# Altium schematic sheet Gero_Board..SchDoc
size B; SheetNumber: 2; SheetTotal: 3
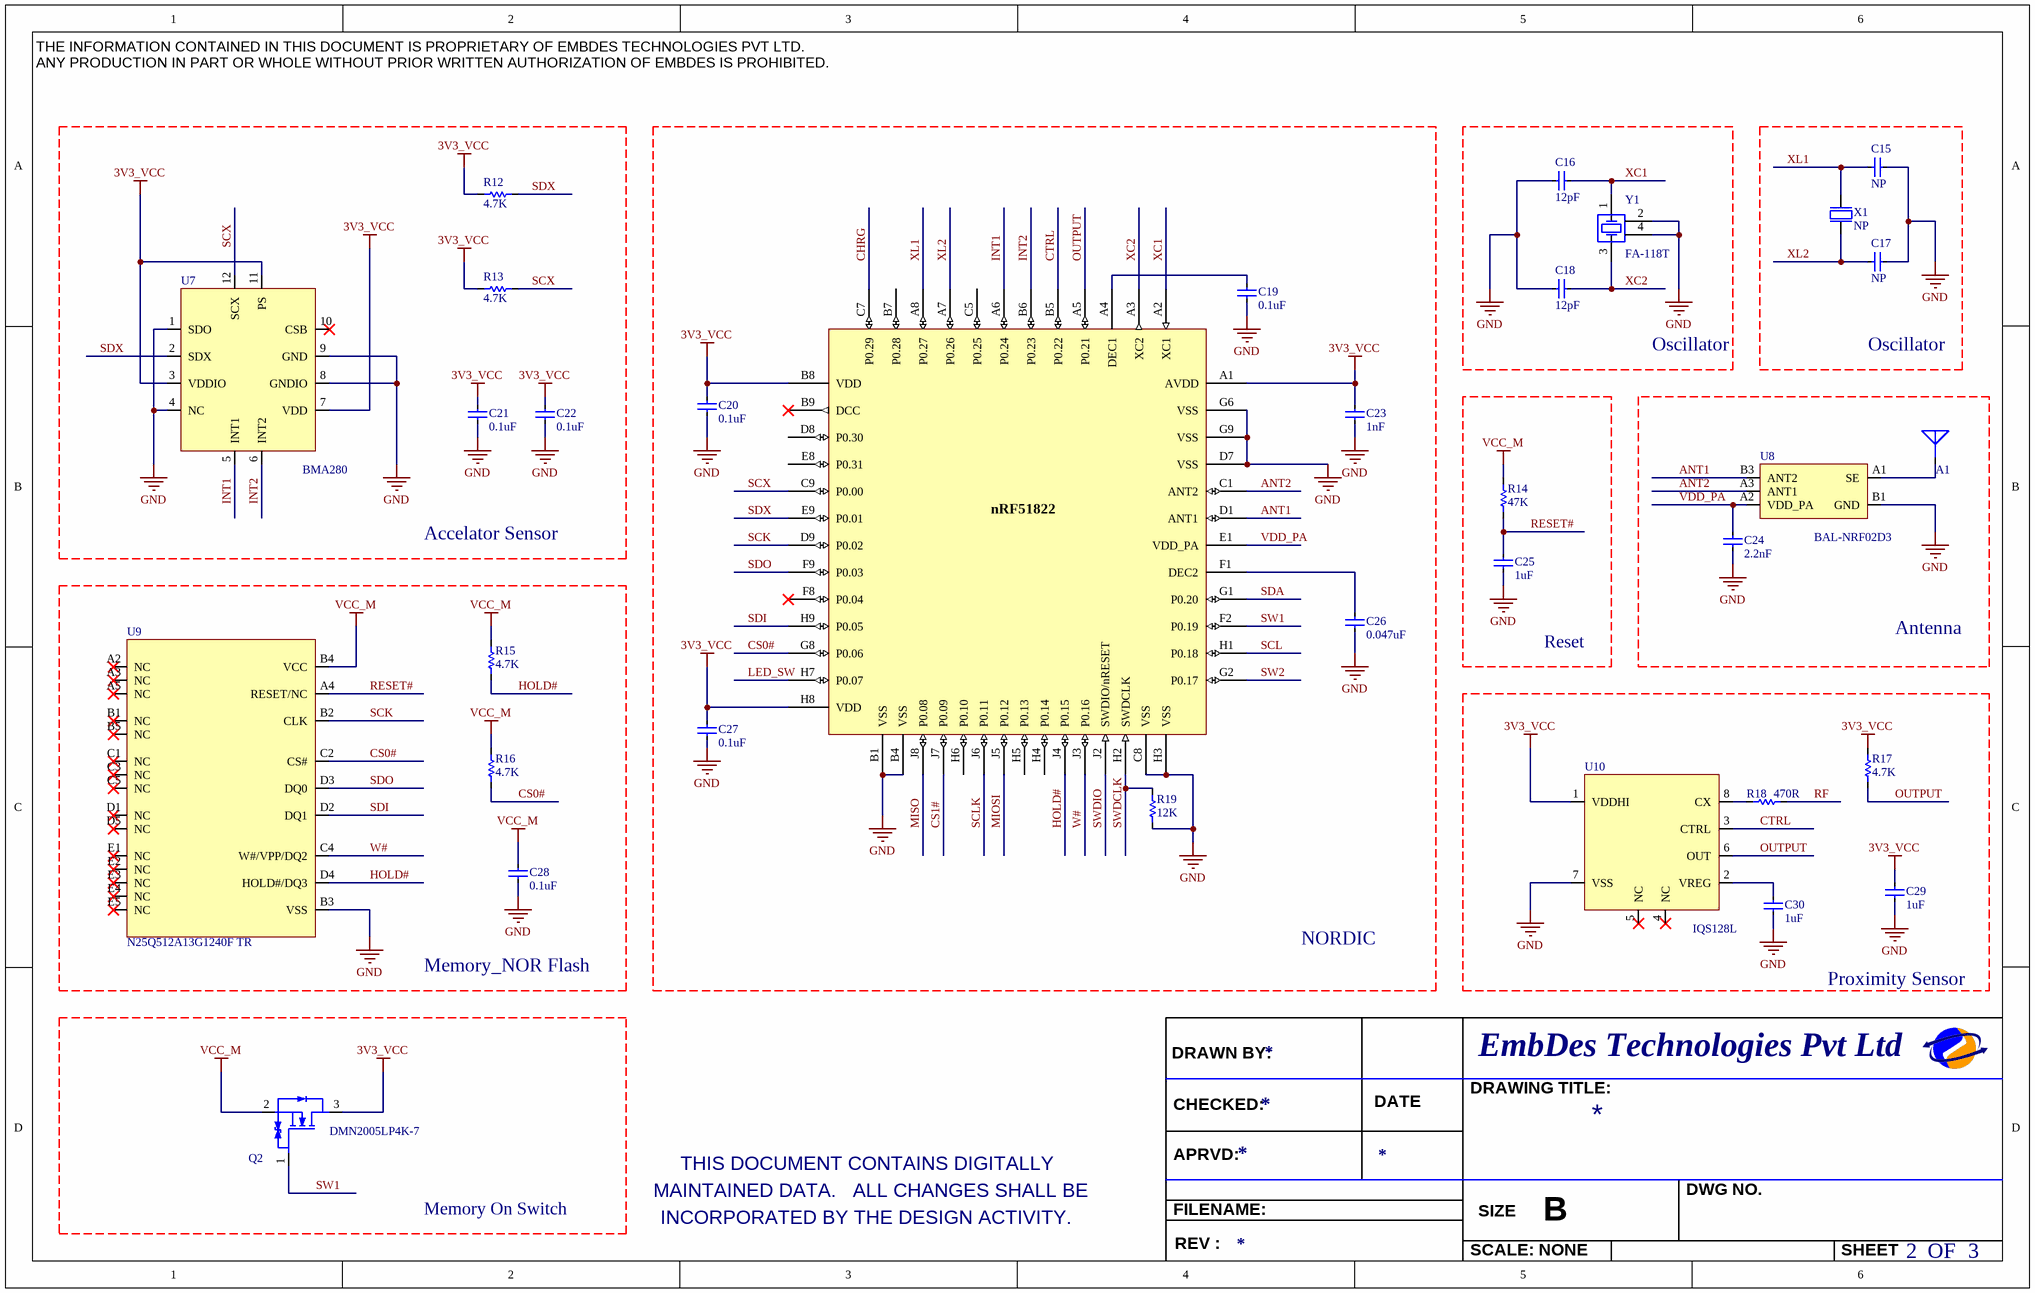
[diagram p0: Gero_Board..SchDoc]

## Parts
*1  ol Bluetooth Low Energy and 2.4GHz proprietary system-on-chip  (value not drawn)
A1  DCAK0008-Dielectric Chip Antenna  (value not drawn)
C15  value NP  [CAPC1005X04L]  (hidden comment: CAP CER 12PF 25V 5% NP0 0201)
C16  value 12pF  [CAPC1005X04L]  (hidden comment: CAP CER 12PF 25V 5% NP0 0201)
C17  value NP  [CAPC1005X04L]  (hidden comment: CAP CER 12PF 25V 5% NP0 0201)
C18  value 12pF  [CAPC1005X04L]  (hidden comment: CAP CER 12PF 25V 5% NP0 0201)
C19  value 0.1uF  [CAPC1005X04L]  (hidden comment: CAP CER 0.1UF 16V 10% X5R 0201)
C20  value 0.1uF  [CAPC1005X04L]  (hidden comment: CAP CER 0.1UF 16V 10% X5R 0201)
C21  value 0.1uF  [CAPC1005X04L]  (hidden comment: CAP CER 0.1UF 16V 10% X5R 0201)
C22  value 0.1uF  [CAPC1005X04L]  (hidden comment: CAP CER 0.1UF 16V 10% X5R 0201)
C23  value 1nF  [CAPC1005X04L]  (hidden comment: CAP CER 1000PF 25V 10% X7R 0201)
C24  value 2.2nF  [CAPC1005X04L]  (hidden comment: CAP CER 2200PF 16V 10% X7R 0201)
C25  value 1uF  [CAPC1005X04L]  (hidden comment: CAP CER 1UF 16V 10% X5R 0402)
C26  value 0.047uF  [CAPC1005X04L]  (hidden comment: CAP CER 0.047UF 16V 10% X6S 0201)
C27  value 0.1uF  [CAPC1005X04L]  (hidden comment: CAP CER 0.1UF 16V 10% X5R 0201)
C28  value 0.1uF  [CAPC1005X04L]  (hidden comment: CAP CER 0.1UF 16V 10% X5R 0201)
C29  value 1uF  [CAPC1005X04L]  (hidden comment: CAP CER 1UF 16V 10% X5R 0402)
C30  value 1uF  [CAPC1005X04L]  (hidden comment: CAP CER 1UF 16V 10% X5R 0402)
Q2  MFG PART NO: DMN2005LP4K-7  (hidden comment: MOSFET N-CH 20V 200MA 3-DFN)
R12  value 4.7K  [R0402]  (hidden comment: RES 4.7K OHM 1/20W 1% 0201 SMD)
R13  value 4.7K  [R0402]  (hidden comment: RES 4.7K OHM 1/20W 1% 0201 SMD)
R14  value 47K  [R0402]  (hidden comment: RES 47K OHM 1/20W 1% 0201 SMD)
R15  value 4.7K  [R0402]  (hidden comment: RES 4.7K OHM 1/20W 1% 0201 SMD)
R16  value 4.7K  [R0402]  (hidden comment: RES 4.7K OHM 1/20W 1% 0201 SMD)
R17  value 4.7K  [R0402]  (hidden comment: RES 4.7K OHM 1/20W 1% 0201 SMD)
R18  value 470R  [R0402]  (hidden comment: RES 470 OHM 1/20W 1% 0201 SMD)
R19  value 12K  [R0402]  (hidden comment: RES 12K OHM 1/20W 1% 0201 SMD)
U7  Manufacturer Part Number: BMA280  (hidden comment: SENSOR ACCELEROMETER)
U8  50 ohm balun transformer for 2.45GHz ISM  [BAL-NRF02D3]  (value not drawn)
U9  Manufacturer Part Number: N25Q512A13G1240F TR  [N25Q512A13G1240F]  (hidden comment: IC FLASH 128MX4 SLC TBGA DDP)
U10  Manufacturer Part No: IQS128L  [IQS128]  (hidden comment: Single Channel Capacitive Proximity/Touch Controller)
X1  value NP  (hidden comment: xtal)
Y1  MHz Range Crystal Unit Ultra Miniature Size Low Profile SMD  [FA-118T]  (value not drawn)

## Nets
3V3_VCC: *1.A1(AVDD) *1.B8(VDD) *1.H8(VDD) C20.2 C21.2 C22.2 C23.2 C27.2 C29.2 Q2.3(D) R12.1 R13.1 R17.2 U7.3(VDDIO) U7.7(VDD) U7.11(PS) U10.1(VDDHI)
GND: *1.B1(VSS) *1.B4(VSS) *1.C8(VSS) *1.D7(VSS) *1.G6(VSS) *1.G9(VSS) *1.H3(VSS) C15.2 C16.1 C17.2 C18.1 C19.1 C20.1 C21.1 C22.1 C23.1 C24.1 C25.1 C26.1 C27.1 C28.1 C29.1 C30.1 R19.1 U7.1(SDO) U7.4(NC) U7.8(GNDIO) U7.9(GND) U8.B1(GND) U9.B3(VSS) U10.7(VSS) Y1.2(GND) Y1.4(GND)
VCC_M: C28.2 Q2.2(S) R14.2 R15.2 R16.2 U9.B4(VCC)
ANT1: *1.D1(ANT1) U8.B3(ANT2)
ANT2: *1.C1(ANT2) U8.A3(ANT1)
CHRG: *1.C7(P0.29)
CS0#: *1.G8(P0.06) R16.1 U9.C2(CS#)
CS1#: *1.J7(P0.09)
CTRL: *1.B5(P0.22) U10.3(CTRL)
HOLD#: *1.J4(P0.15) R15.1 U9.D4(HOLD#/DQ3)
INT1: *1.A6(P0.24) U7.5(INT1)
INT2: *1.B6(P0.23) U7.6(INT2)
LED_SW: *1.H7(P0.07)
MIOSI: *1.J5(P0.12)
MISO: *1.J8(P0.08)
OUTPUT: *1.A5(P0.21) R17.1 U10.6(OUT)
RESET#: C25.2 R14.1 U9.A4(RESET/NC)
RF: R18.2
SCK: *1.D9(P0.02) U9.B2(CLK)
SCL: *1.H1(P0.18)
SCLK: *1.J6(P0.11)
SCX: *1.C9(P0.00) R13.2 U7.12(SCX)
SDA: *1.G1(P0.20)
SDI: *1.H9(P0.05) U9.D2(DQ1)
SDO: *1.F9(P0.03) U9.D3(DQ0)
SDX: *1.E9(P0.01) R12.2 U7.2(SDX)
SW1: *1.F2(P0.19) Q2.1(G)
SW2: *1.G2(P0.17)
SWDCLK: *1.H2(SWDCLK) R19.2
SWDIO: *1.J2(SWDIO/nRESET)
VDD_PA: *1.E1(VDD_PA) C24.2 U8.A2(VDD_PA)
W#: *1.J3(P0.16) U9.C4(W#/VPP/DQ2)
XC1: *1.A2(XC1) C16.2 Y1.1(XTAL_IN)
XC2: *1.A3(XC2) C18.2 Y1.3(XTAL_OUT)
XL1: *1.A8(P0.27) C15.1 X1.1(inp)
XL2: *1.A7(P0.26) C17.1 X1.3(out)
Net*1_A4: *1.A4(DEC1) C19.2
Net*1_F1: *1.F1(DEC2) C26.2
NetC30_2: C30.2 U10.2(VREG)
NetR18_1: R18.1 U10.8(CX)

Not connected (* = marked no-connect by the designer): *1 B7(P0.28) B9(DCC)* C5(P0.25) D8(P0.30) E8(P0.31) F8(P0.04)* H4(P0.14) H5(P0.13) H6(P0.10); A1 1(A); U7 10(CSB)*; U8 A1(SE); U9 A2(NC)* A3(NC)* A5(NC)* B1(NC)* B5(NC)* C1(NC)* C3(NC)* C5(NC)* D1(NC)* D5(NC)* E1(NC)* E2(NC)* E3(NC)* E4(NC)* E5(NC)*; U10 4(NC)* 5(NC)*

## Notes on the sheet
- Oscillator
- Accelator Sensor
- Antenna
- Reset
- Memory_NOR Flash
- NORDIC
- Proximity Sensor
- Memory On Switch
- THE INFORMATION CONTAINED IN THIS DOCUMENT IS PROPRIETARY OF EMBDES TECHNOLOGIES PVT LTD.
  ANY PRODUCTION IN PART OR WHOLE WITHOUT PRIOR WRITTEN AUTHORIZATION OF EMBDES IS PROHIBITED.
- DRAWN BY:
- CHECKED:
- DATE
- DRAWING TITLE:
- EmbDes Technologies Pvt Ltd
- THIS DOCUMENT CONTAINS DIGITALLY
- APRVD:
- MAINTAINED DATA.   ALL CHANGES SHALL BE
- INCORPORATED BY THE DESIGN ACTIVITY.
- FILENAME:
- SIZE
- B
- DWG NO.
- REV :
- SCALE: NONE
- SHEET
- OF
- (in symbol ol Bluetooth Low Energy and 2.4GHz proprietary system-on-chip) nRF51822

## Library data of the parts
A1 = DCAK0008-Dielectric Chip Antenna: Manufacturer: CIROCOMM TECHNOLOGY; Manufacuturer Part No: 03A40D5M00J0110
C15-C18 = CAP CER 12PF 25V 5% NP0 0201: Manufacturer: TDK Corporation; Manufacturer Part Number: C0603C0G1E120J030BA; Voltage: 25V
C19-C22 C27 C28 = CAP CER 0.1UF 16V 10% X5R 0201: Manufacturer: TDK Corporation; Manufacturer Part Number: C0603X5R1C104K030BC; Voltage: 16V
C23 = CAP CER 1000PF 25V 10% X7R 0201: Manufacturer: TDK Corporation; Manufacturer Part Number: C0603X7R1E102K030BA; Voltage: 25V
C24 = CAP CER 2200PF 16V 10% X7R 0201: Manufacturer: TDK Corporation; Manufacturer Part Number: C0603X7R1C222K030BA; Voltage: 16V
C25 C29 C30 = CAP CER 1UF 16V 10% X5R 0402: Manufacturer: TDK Corporation; Manufacturer Part Number: C1005X5R1C105K050BC; Note: 16V
C26 = CAP CER 0.047UF 16V 10% X6S 0201: Manufacturer: TDK Corporation; Manufacturer Part Number: C0603X6S1C473K030BC; Voltage: 16V
Q2 = MOSFET N-CH 20V 200MA 3-DFN: MANUFACTURER: Diodes Inc
R12 R13 R15-R17 = RES 4.7K OHM 1/20W 1% 0201 SMD: Manufacturer Part Number_1: ERJ-1GEF4701C; Manufacturer: Panasonic Electronic Components; Package: R0201
R14 = RES 47K OHM 1/20W 1% 0201 SMD: Manufacturer Part Number_1: ERJ-1GEF4702C; Manufacturer: Panasonic Electronic Components; Package: R0201
R18 = RES 470 OHM 1/20W 1% 0201 SMD: Manufacturer Part Number_1: ERJ-1GEF4700C; Manufacturer: Panasonic Electronic Components; Package: R0201
R19 = RES 12K OHM 1/20W 1% 0201 SMD: Manufacturer Part Number_1: ERJ-1GEF1202C; Manufacturer_1: Panasonic Electronic Components; Package: R0201
U7 = SENSOR ACCELEROMETER: Manufacturer: Bosch Sensortec
U8 = 50 ohm balun transformer for 2.45GHz ISM: Manufacturer: ST Microelectronics; Manufacturer Part Number: BAL-NRF02D3
U9 = IC FLASH 128MX4 SLC TBGA DDP: Manufacturer: Micron Technology Inc
U10 = Single Channel Capacitive Proximity/Touch Controller: Manufacturer: Azoteq
Y1 = MHz Range Crystal Unit Ultra Miniature Size Low Profile SMD: Manufacturer: EPSON; Manufacturer Part Number: FA-118T
X1 = xtal: Manufacturer: *; Manufacturer Part Number: *